# Altium schematic sheet ft600.SchDoc
size A3
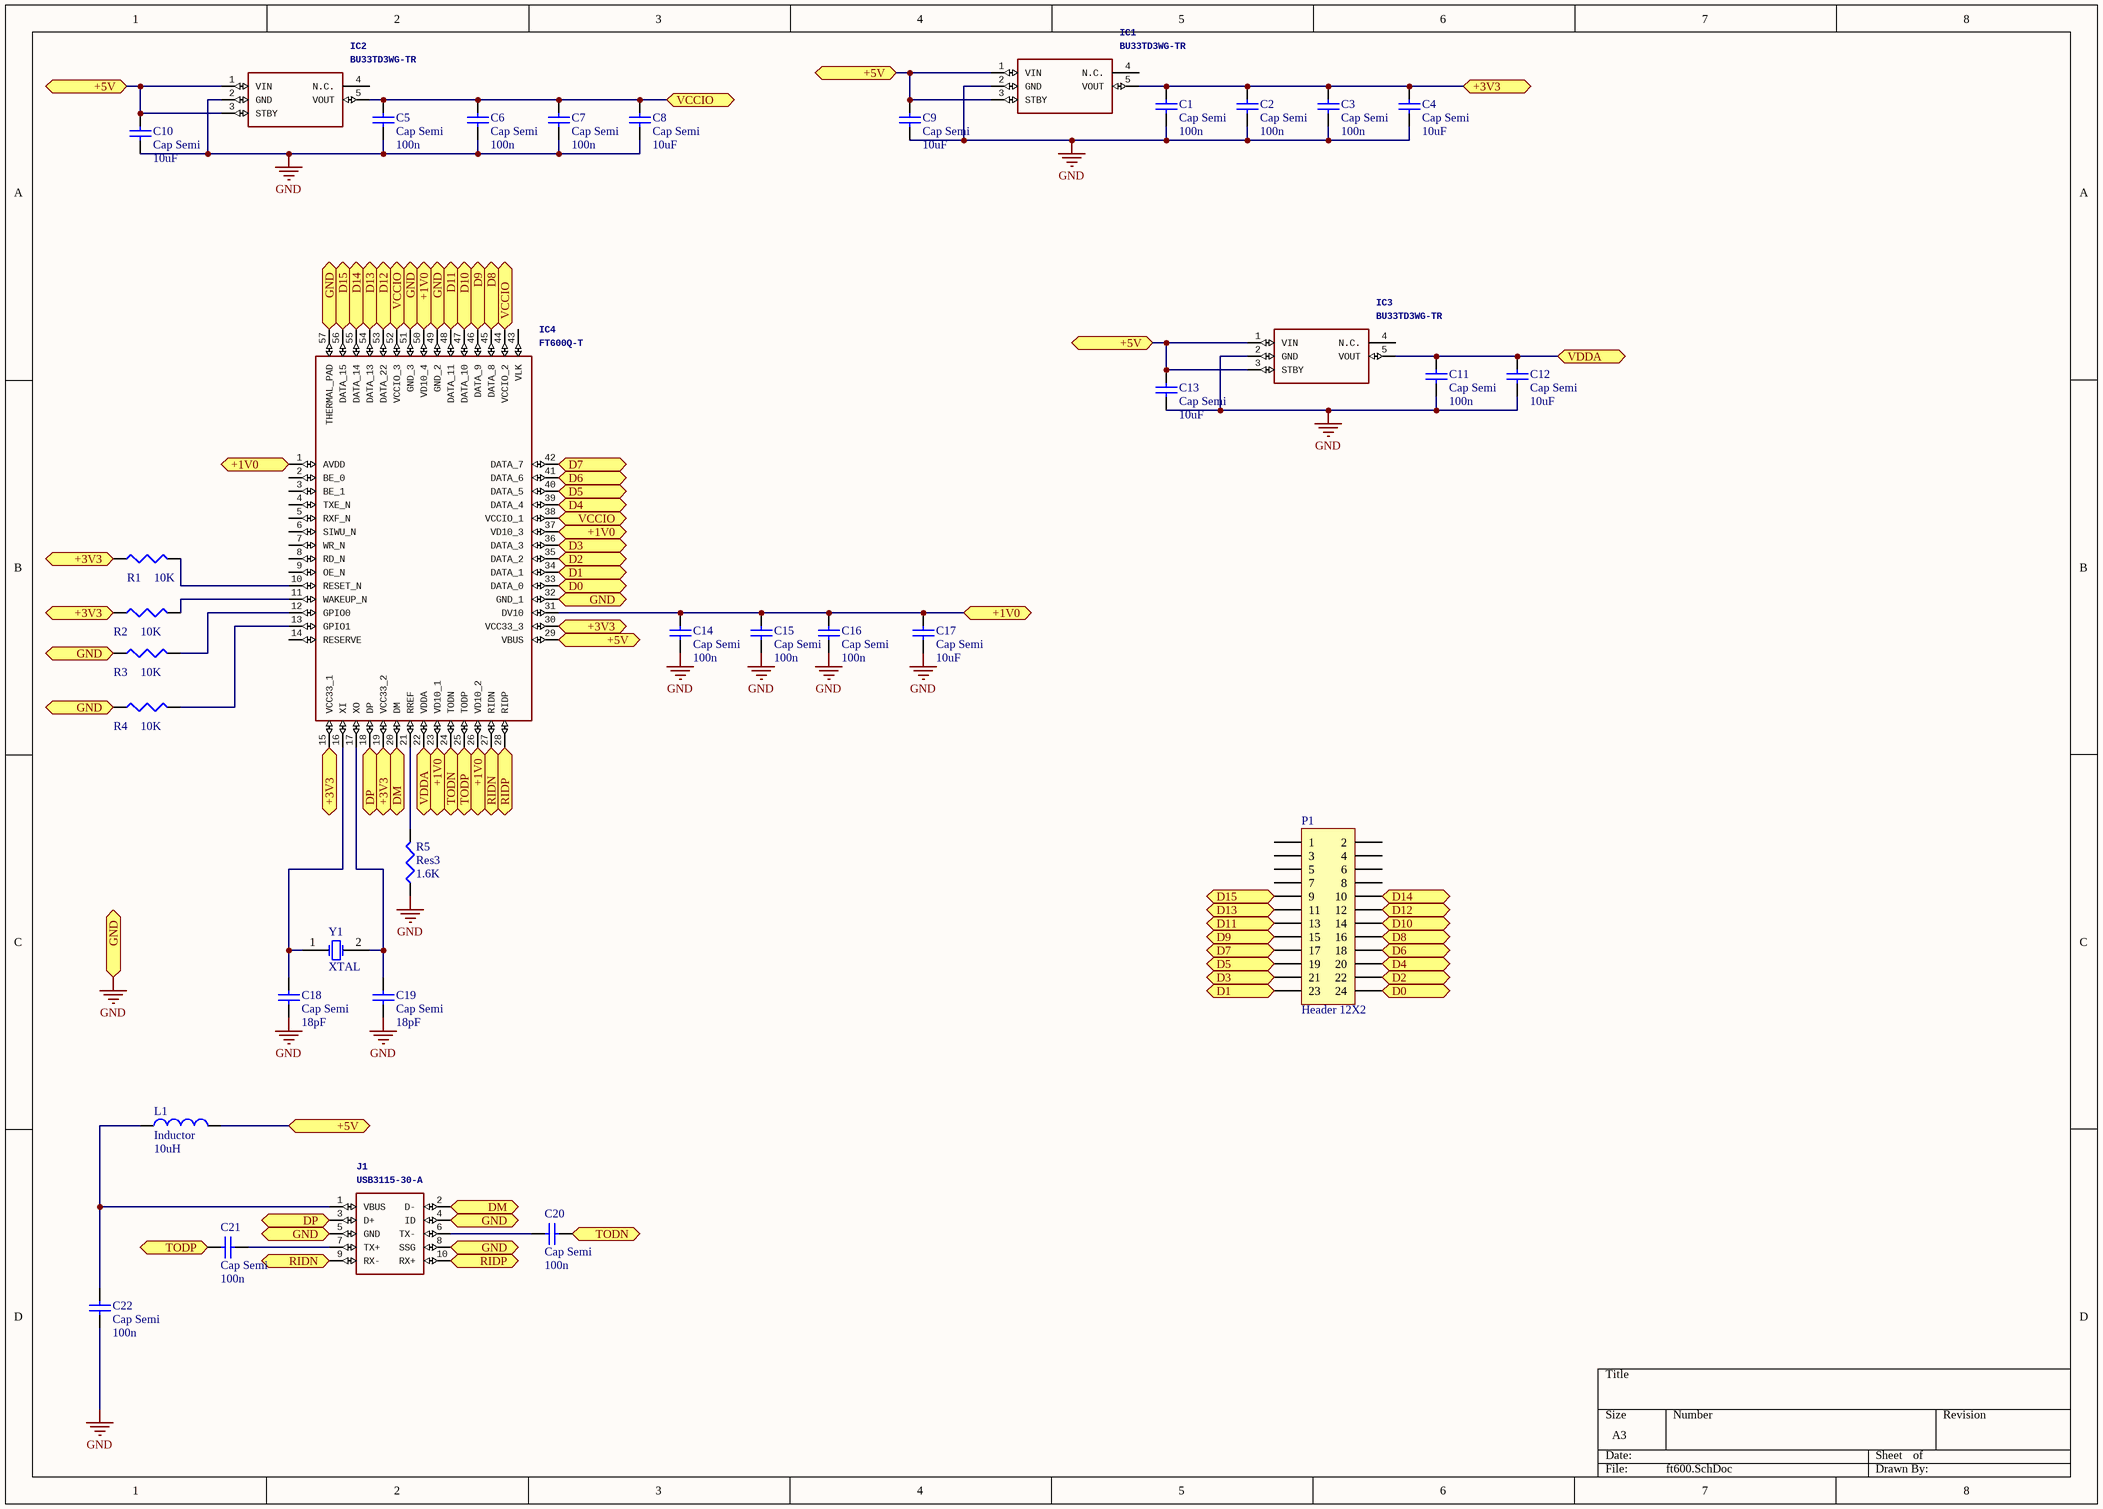
[diagram p0: ft600.SchDoc]

## Parts
C1  Cap Semi  value 100n  [1608[0603]]
C2  Cap Semi  value 100n  [1608[0603]]
C3  Cap Semi  value 100n  [1608[0603]]
C4  Cap Semi  value 10uF  [RESC2012X60N]
C5  Cap Semi  value 100n  [1608[0603]]
C6  Cap Semi  value 100n  [1608[0603]]
C7  Cap Semi  value 100n  [1608[0603]]
C8  Cap Semi  value 10uF  [RESC2012X60N]
C9  Cap Semi  value 10uF  [RESC2012X60N]
C10  Cap Semi  value 10uF  [RESC2012X60N]
C11  Cap Semi  value 100n  [1608[0603]]
C12  Cap Semi  value 10uF  [RESC2012X60N]
C13  Cap Semi  value 10uF  [RESC2012X60N]
C14  Cap Semi  value 100n  [1608[0603]]
C15  Cap Semi  value 100n  [1608[0603]]
C16  Cap Semi  value 100n  [1608[0603]]
C17  Cap Semi  value 10uF  [RESC2012X60N]
C18  Cap Semi  value 18pF  [1608[0603]]
C19  Cap Semi  value 18pF  [1608[0603]]
C20  Cap Semi  value 100n  [1608[0603]]
C21  Cap Semi  value 100n  [1608[0603]]
C22  Cap Semi  value 100n  [1608[0603]]
IC1  BU33TD3WG-TR  [SOT95P280X125-5N]
IC2  BU33TD3WG-TR  [SOT95P280X125-5N]
IC3  BU33TD3WG-TR  [SOT95P280X125-5N]
IC4  FT600Q-T  [QFN40P700X700X90-57N]
J1  USB3115-30-A  [USB3115]
L1  Inductor  value 10uH  [RESC2012X60N]
P1  Header 12X2  [HDR2X12]
R1  value 10K  [J1-0603]  (hidden comment: Res3)
R2  value 10K  [J1-0603]  (hidden comment: Res3)
R3  value 10K  [J1-0603]  (hidden comment: Res3)
R4  value 10K  [J1-0603]  (hidden comment: Res3)
R5  Res3  value 1.6K  [J1-0603]
Y1  XTAL  [C1210_M]

## Ports
+1V0, +3V3, +5V, D0, D1, D2, D3, D4, D5, D6, D7, D8, D9, D10, D11, D12, D13, D14, D15, DM, DP, GND, RIDN, RIDP, TODN, TODP, VCCIO, VDDA

## Nets
GND: C1.1 C2.1 C3.1 C4.1 C5.1 C6.1 C7.1 C8.1 C9.1 C10.1 C11.1 C12.1 C13.1 C14.1 C15.2 C16.1 C17.1 C18.1 C19.1 C22.2 IC1.2(GND) IC2.2(GND) IC3.2(GND) IC4.32(GND_1) IC4.49(GND_2) IC4.51(GND_3) IC4.57(THERMAL_PAD) J1.4(ID) J1.5(GND) J1.8(SSG) R3.1 R4.1 R5.1 ; port GND
+1V0: C14.2 C15.1 C16.2 C17.2 IC4.1(AVDD) IC4.23(VD10_1) IC4.26(VD10_2) IC4.31(DV10) IC4.37(VD10_3) IC4.50(VD10_4) ; port +1V0
+3V3: C1.2 C2.2 C3.2 C4.2 IC1.5(VOUT) IC4.15(VCC33_1) IC4.19(VCC33_2) IC4.30(VCC33_3) R1.1 R2.1 ; port +3V3
+5V: C9.2 C10.2 C13.2 IC1.1(VIN) IC1.3(STBY) IC2.1(VIN) IC2.3(STBY) IC3.1(VIN) IC3.3(STBY) IC4.29(VBUS) L1.2 ; port +5V
D0: IC4.33(DATA_0) P1.24 ; port D0
D1: IC4.34(DATA_1) P1.23 ; port D1
D2: IC4.35(DATA_2) P1.22 ; port D2
D3: IC4.36(DATA_3) P1.21 ; port D3
D4: IC4.39(DATA_4) P1.20 ; port D4
D5: IC4.40(DATA_5) P1.19 ; port D5
D6: IC4.41(DATA_6) P1.18 ; port D6
D7: IC4.42(DATA_7) P1.17 ; port D7
D8: IC4.45(DATA_8) P1.16 ; port D8
D9: IC4.46(DATA_9) P1.15 ; port D9
D10: IC4.47(DATA_10) P1.14 ; port D10
D11: IC4.48(DATA_11) P1.13 ; port D11
D12: IC4.53(DATA_22) P1.12 ; port D12
D13: IC4.54(DATA_13) P1.11 ; port D13
D14: IC4.55(DATA_14) P1.10 ; port D14
D15: IC4.56(DATA_15) P1.9 ; port D15
DM: IC4.20(DM) J1.2(D-) ; port DM
DP: IC4.18(DP) J1.3(D+) ; port DP
RIDN: IC4.27(RIDN) J1.9(RX-) ; port RIDN
RIDP: IC4.28(RIDP) J1.10(RX+) ; port RIDP
TODN: C20.2 IC4.24(TODN) ; port TODN
TODP: C21.1 IC4.25(TODP) ; port TODP
VCCIO: C5.2 C6.2 C7.2 C8.2 IC2.5(VOUT) IC4.38(VCCIO_1) IC4.44(VCCIO_2) IC4.52(VCCIO_3) ; port VCCIO
VDDA: C11.2 C12.2 IC3.5(VOUT) IC4.22(VDDA) ; port VDDA
NetC18_2: C18.2 IC4.16(XI) Y1.1(OSC1)
NetC19_2: C19.2 IC4.17(XO) Y1.2(OSC2)
NetC20_1: C20.1 J1.6(TX-)
NetC21_2: C21.2 J1.7(TX+)
NetC22_1: C22.1 J1.1(VBUS) L1.1
NetIC4_10: IC4.10(RESET_N) R1.2
NetIC4_11: IC4.11(WAKEUP_N) R2.2
NetIC4_12: IC4.12(GPIO0) R3.2
NetIC4_13: IC4.13(GPIO1) R4.2
NetIC4_21: IC4.21(RREF) R5.2

Not connected (* = marked no-connect by the designer): IC1 4(N.C.); IC2 4(N.C.); IC3 4(N.C.); IC4 2(BE_0) 3(BE_1) 4(TXE_N) 5(RXF_N) 6(SIWU_N) 7(WR_N) 8(RD_N) 9(OE_N) 14(RESERVE) 43(VLK); P1 1 2 3 4 5 6 7 8

## Library data of the parts
C1-C22 = Cap Semi: Capacitor (Semiconductor SIM Model); Published: 8-Jun-2000; LatestRevisionDate: 29-May-2009; LatestRevisionNote: IPC-7351 Footprint Added.; PackageReference: C1206; Publisher: Altium Limited; PackageDescription: Chip Capacitor
IC1-IC3 = BU33TD3WG-TR: Manufacturer_Name: ROHM Semiconductor; GateName_1: G$1; SymbolName_1: BU33TD3WG-TR; LibraryName: BU33TD3WG-TR; DeviceSetName: BU33TD3WG-TR; Manufacturer_Part_Number: BU33TD3WG-TR; RS_Part_Number: 1246518; RS_Price-Stock: http://uk.rs-online.com/web/p/products/1246518; Arrow_Part_Number: BU33TD3WG-TR; Arrow_Price-Stock: http://uk.rs-online.com/web/p/products/1246518; Height: 1.25mm
IC4 = FT600Q-T: Manufacturer_Name: FTDI Chip; GateName_1: G$1; SymbolName_1: FT600Q-T; LibraryName: FT600Q-T; DeviceSetName: FT600Q-T; Manufacturer_Part_Number: FT600Q-T; RS_Part_Number: 8750003P; RS_Price-Stock: http://uk.rs-online.com/web/p/products/8750003P; Arrow_Part_Number: FT600Q-T; Arrow_Price-Stock: https://www.arrow.com/en/products/ft600q-t/ftdi-chip; Height: 0.9mm
J1 = USB3115-30-A: Manufacturer_Name: GLOBAL CONNECTOR TECHNOLOGY; GateName_1: G$1; SymbolName_1: USB3115-30-A; LibraryName: USB3115-30-A; DeviceSetName: USB3115-30-A; Manufacturer_Part_Number: USB3115-30-A; Arrow_Part_Number: USB3115-30-A; Height: mm
L1 = Inductor: Code_IEC: 1005; Published: 8-Jun-2000; LatestRevisionDate: 29-May-2009; LatestRevisionNote: IPC-7351 Footprint Added.; PackageReference: 0402-A; Publisher: Altium Limited; PackageDescription: Chip Inductor; Code_JEITA: 0402
P1 = Header 12X2: Header, 12-Pin, Dual row; LatestRevisionDate: 17-Jul-2002; LatestRevisionNote: Re-released for DXP Platform.; Publisher: Altium Limited
R1-R5 = Res3: Resistor; Published: 8-Jun-2000; LatestRevisionDate: 29-May-2009; LatestRevisionNote: IPC-7351 Footprint Added.; PackageReference: J1-0603; Publisher: Altium Limited; PackageDescription: Chip Resistor
Y1 = XTAL: Crystal Oscillator; Published: 8-Jun-2000; LatestRevisionDate: 17-Jul-2002; LatestRevisionNote: Re-released for DXP Platform.; PackageReference: R38; Publisher: Altium Limited; PackageDescription: Crystal, Thru-Hole; 2 Leads; Body 3.1 x 8.2 mm (Dia.xH)